# Altium schematic sheet lm2700.SchDoc
size A4
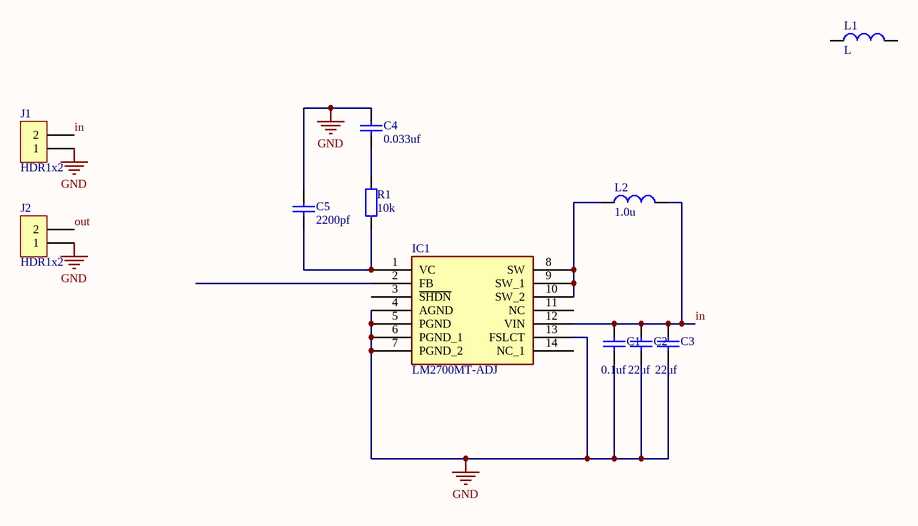
[diagram p0: lm2700.SchDoc]

## Parts
C1  0.1uf  [2220]
C2  22uf  [2220]
C3  22uf  [2220]
C4  0.033uf  [2220]
C5  2200pf  [2220]
IC1  LM2700MT-ADJ  [SOP65P640X120-14N]
J1  HDR1x2  [PIN-2-2.54-1.0]
J2  HDR1x2  [PIN-2-2.54-1.0]
L1  L  [L4R7]
L2  1.0u  [L4R7]
R1  10k  [2220]

## Nets
GND: C1.1 C2.1 C3.1 C4.2 C5.2 IC1.4(AGND) IC1.5(PGND) IC1.6(PGND_1) IC1.7(PGND_2) IC1.13(FSLCT) J1.1 J2.1
in: C1.2 C2.2 C3.2 IC1.12(VIN) J1.2 L2.2
out: J2.2
NetC4_1: C4.1 R1.2
NetC5_1: C5.1 IC1.1(VC) R1.1
NetIC1_8: IC1.8(SW) IC1.9(SW_1) IC1.10(SW_2) L2.1

Not connected (* = marked no-connect by the designer): IC1 2(FB) 3(~{SHDN}) 11(NC) 14(NC_1); L1 1 2

## Library data of the parts
C1-C5 = C: 电容
IC1 = LM2700MT-ADJ: Integrated Circuit; Manufacturer_Name: Texas Instruments; Datasheet Link: http://www.ti.com/lit/ds/symlink/lm2700.pdf; Height: 1.2mm; Manufacturer_Part_Number: LM2700MT-ADJ; Mouser Part Number: 926-LM2700MT-ADJ; Mouser Price/Stock: https://www.mouser.com/Search/Refine.aspx?Keyword=926-LM2700MT-ADJ; RS Part Number: 4432079; RS Price/Stock: http://uk.rs-online.com/web/p/products/4432079
J1 J2 = HDR1x2: Connector
L1 L2 = L: 大号贴片电感
R1 = R: 电阻